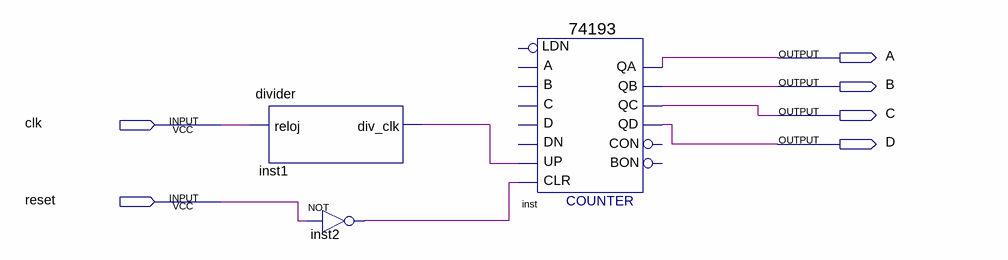
[diagram p0: schematic sheet]
// Quartus schematic Practica1.bdf as structural Verilog: 3 symbols, 6 pins
module Practica1 (
  input  clk,
  input  reset,
  output A,
  output B,
  output C,
  output D
);

  wire inst1_div_clk, inst2_out;

  divider inst1 (.reloj(clk), .div_clk(inst1_div_clk));
  not inst2 (inst2_out, reset);
  \74193  inst (
    .CLR(inst2_out), .UP(inst1_div_clk), .QB(B), .QA(A), .QD(D), .QC(C));  // open: D, C, B, A, DN, LDN, CON, BON
endmodule
